# Altium schematic sheet 0227_GPU_ DEBUG.SchDoc
size 848 x 558 mm
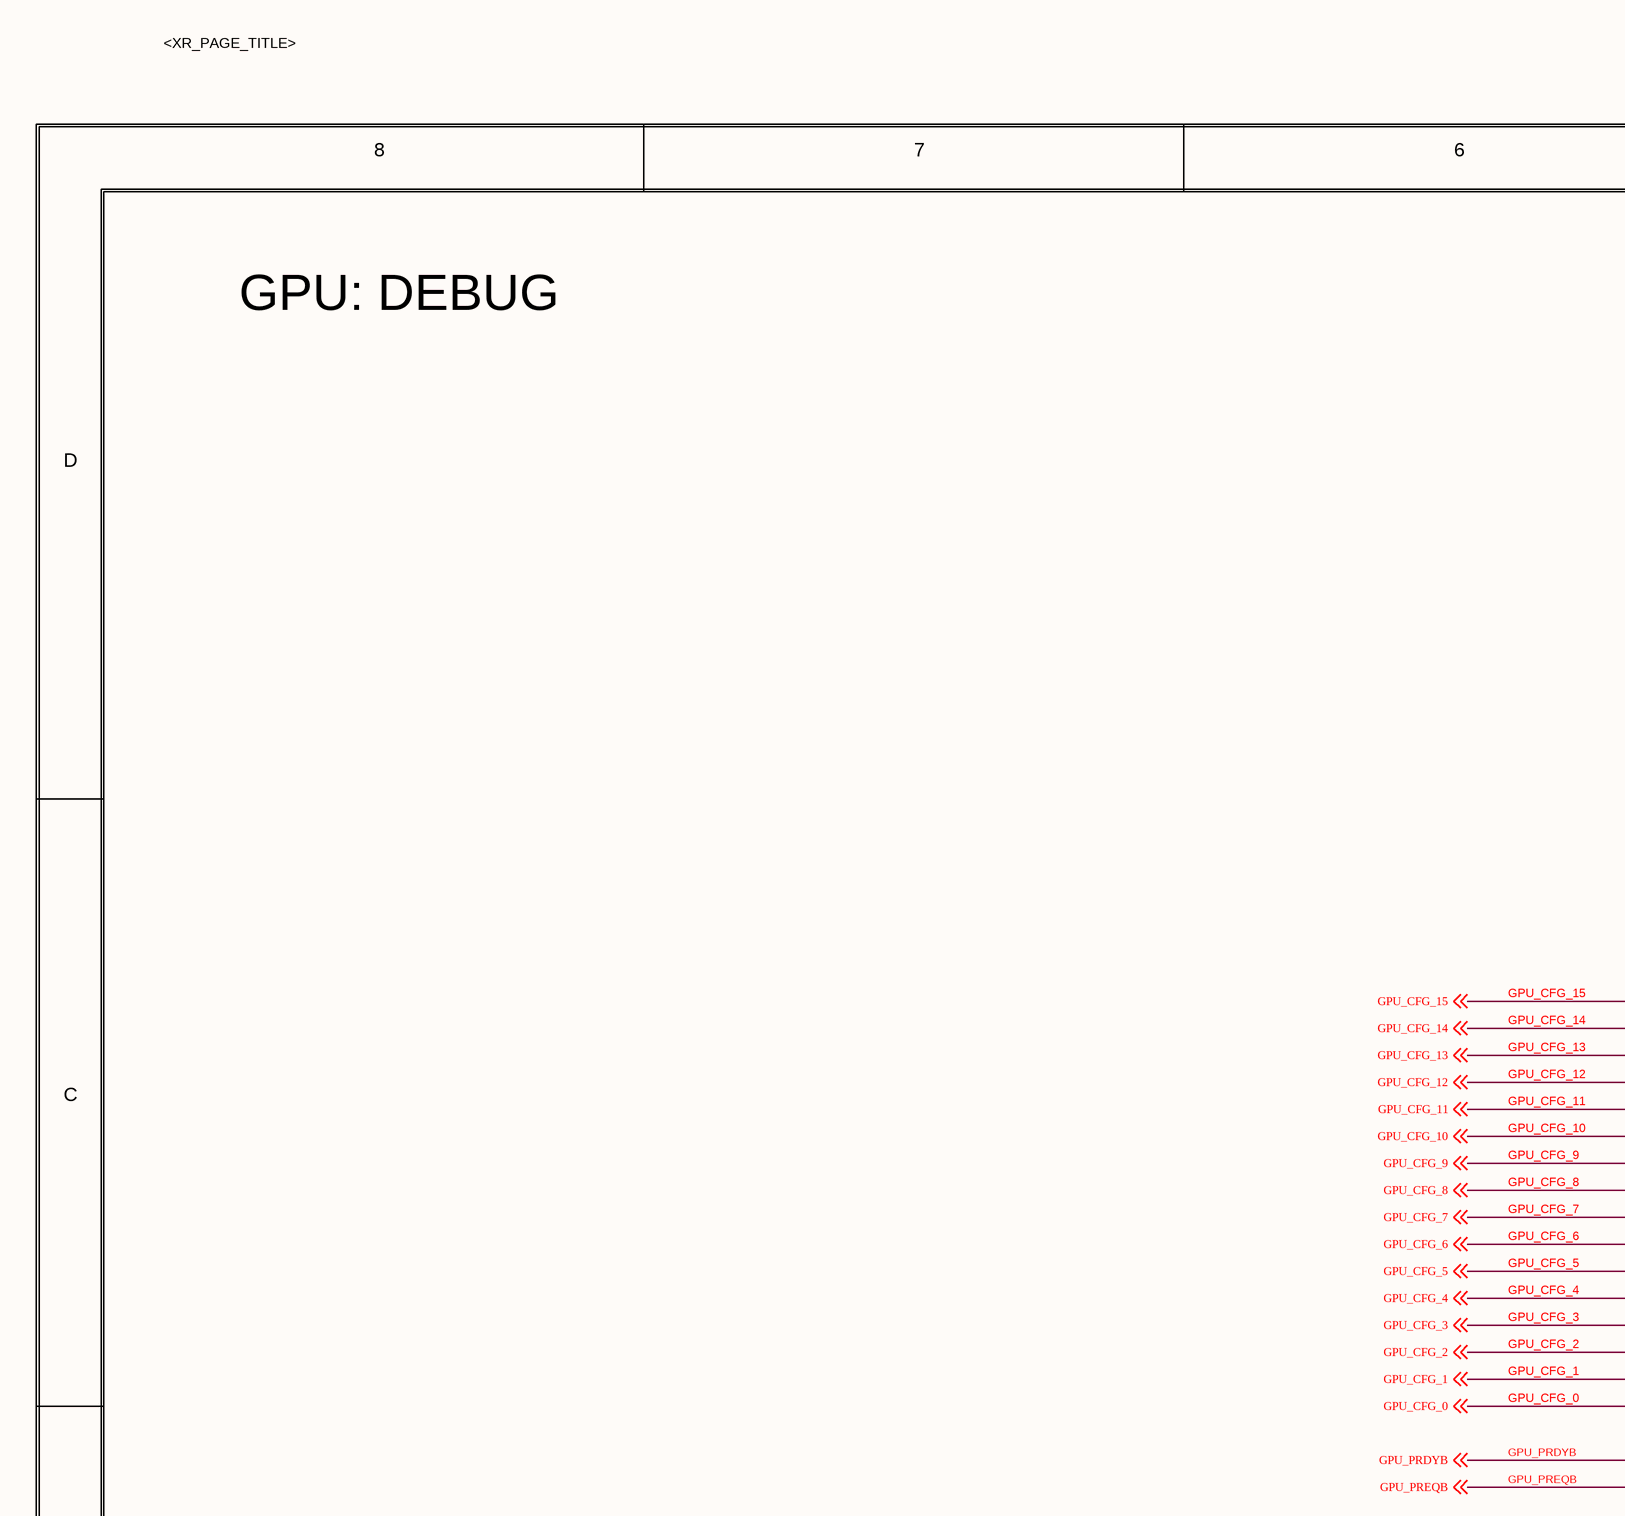
[diagram p0: 0227_GPU_ DEBUG.SchDoc, top left]
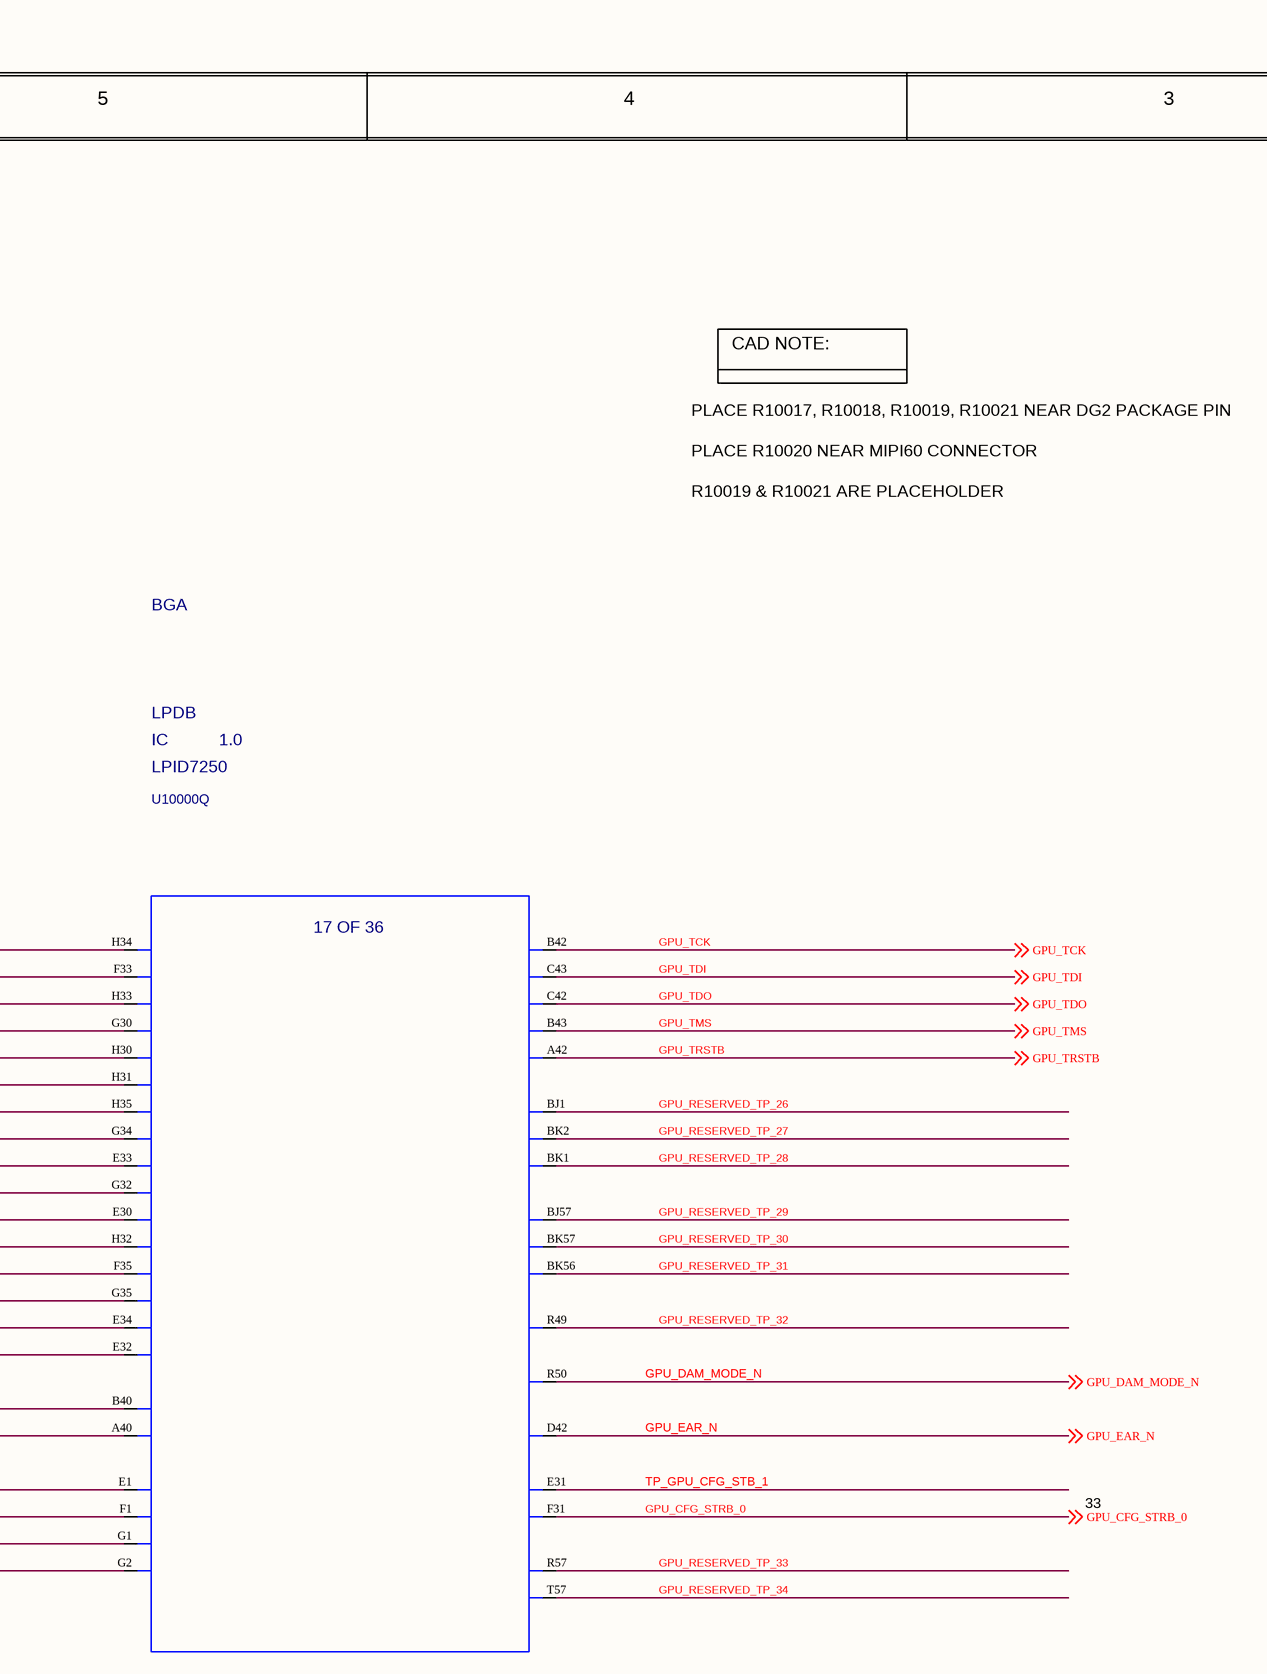
[diagram p1: 0227_GPU_ DEBUG.SchDoc, top middle]
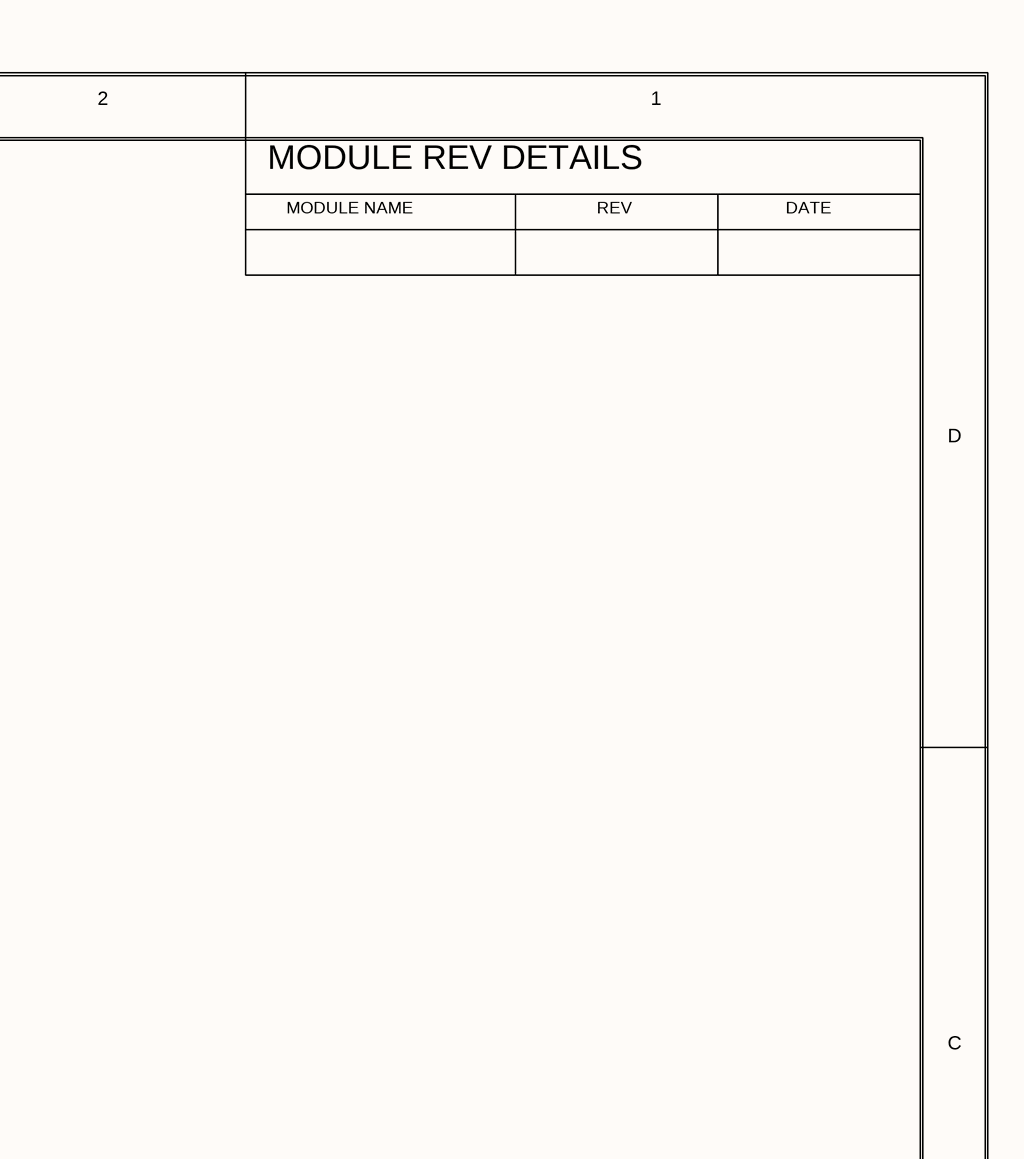
[diagram p2: 0227_GPU_ DEBUG.SchDoc, top right]
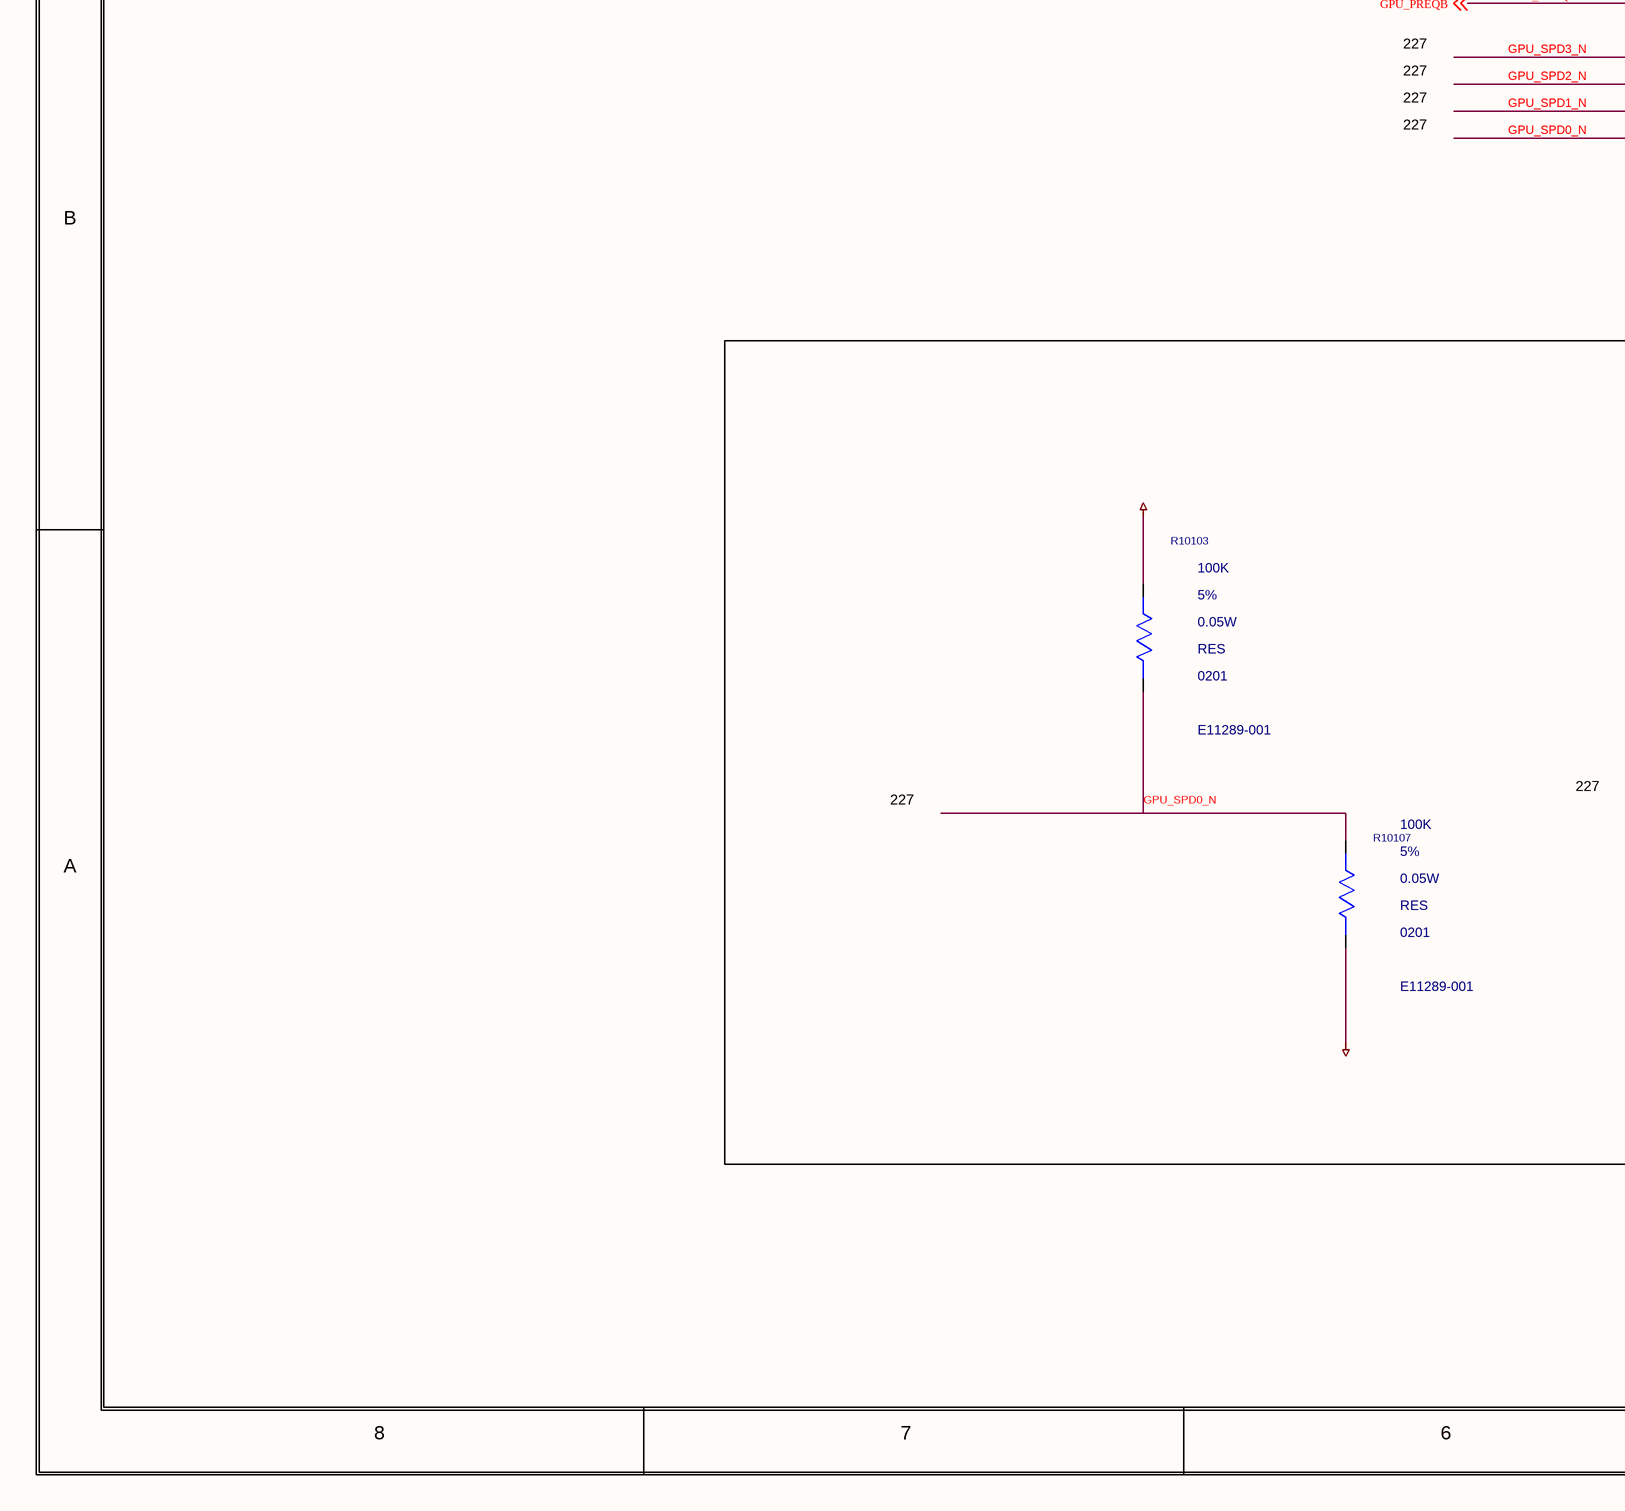
[diagram p3: 0227_GPU_ DEBUG.SchDoc, bottom left]
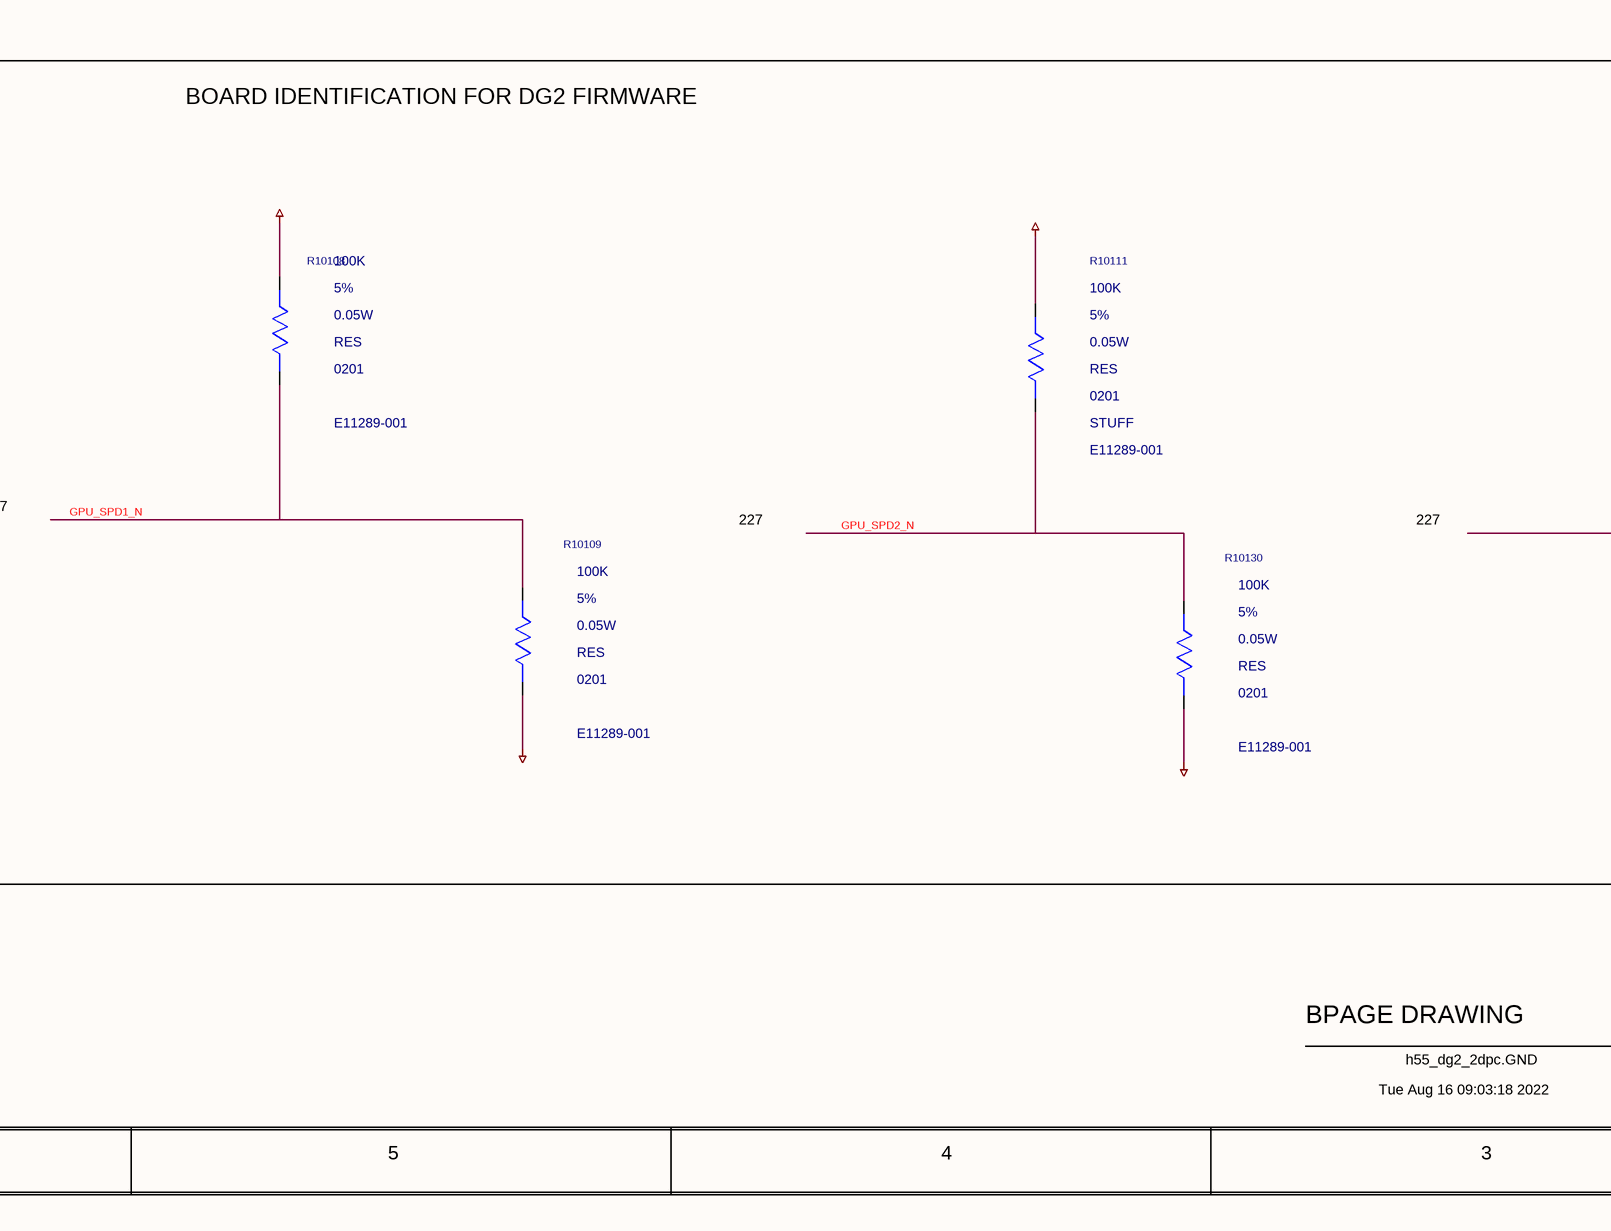
[diagram p4: 0227_GPU_ DEBUG.SchDoc, bottom middle]
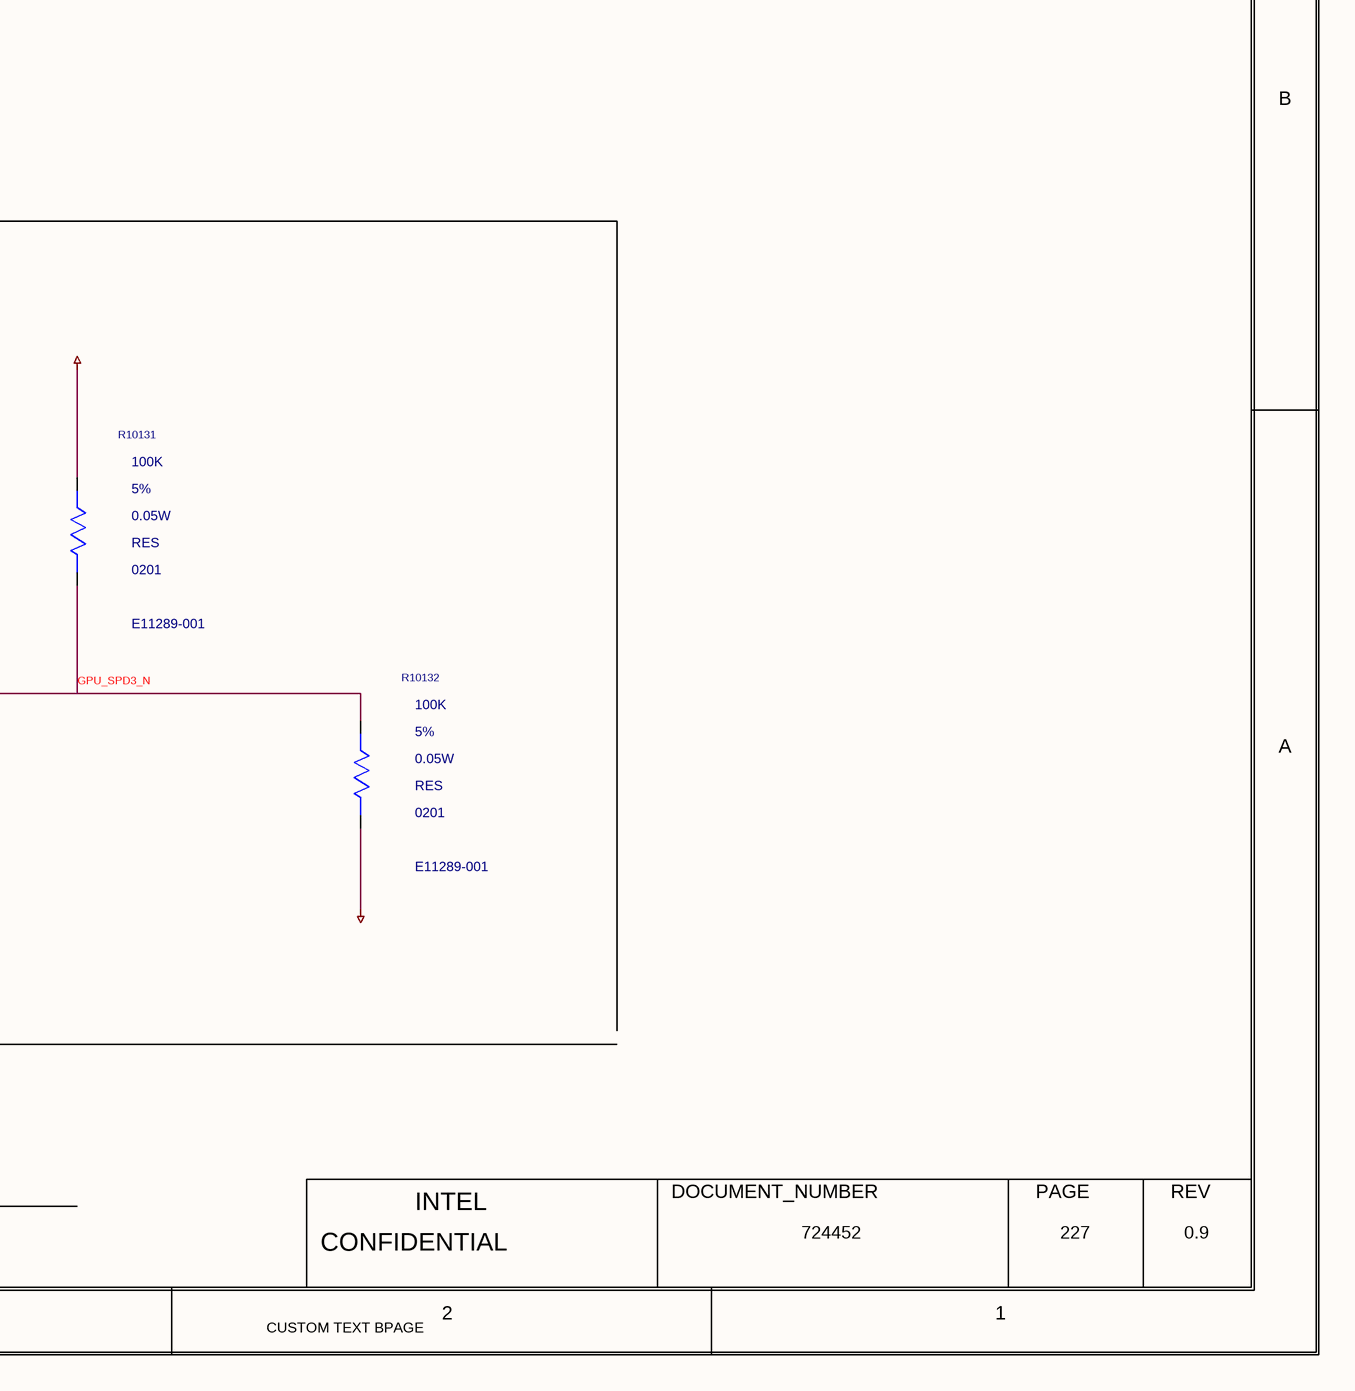
[diagram p5: 0227_GPU_ DEBUG.SchDoc, bottom right]

## Parts
R10103  100K  MATERIAL: RES  PACK_TYPE: 0201  PART_NUMBER: E11289-001  TOLERANCE: 5%  WATTAGE: 0.05W  [TK0_SM0201_650X350_MB]
R10107  100K  MATERIAL: RES  PACK_TYPE: 0201  PART_NUMBER: E11289-001  TOLERANCE: 5%  WATTAGE: 0.05W  [TK0_SM0201_650X350_MB]
R10108  100K  MATERIAL: RES  PACK_TYPE: 0201  PART_NUMBER: E11289-001  TOLERANCE: 5%  WATTAGE: 0.05W  [TK0_SM0201_650X350_MB]
R10109  100K  MATERIAL: RES  PACK_TYPE: 0201  PART_NUMBER: E11289-001  TOLERANCE: 5%  WATTAGE: 0.05W  [TK0_SM0201_650X350_MB]
R10111  100K  BOM_USE: STUFF  MATERIAL: RES  PACK_TYPE: 0201  PART_NUMBER: E11289-001  TOLERANCE: 5%  WATTAGE: 0.05W  [TK0_SM0201_650X350_MB]
R10130  100K  MATERIAL: RES  PACK_TYPE: 0201  PART_NUMBER: E11289-001  TOLERANCE: 5%  WATTAGE: 0.05W  [TK0_SM0201_650X350_MB]
R10131  100K  MATERIAL: RES  PACK_TYPE: 0201  PART_NUMBER: E11289-001  TOLERANCE: 5%  WATTAGE: 0.05W  [TK0_SM0201_650X350_MB]
R10132  100K  MATERIAL: RES  PACK_TYPE: 0201  PART_NUMBER: E11289-001  TOLERANCE: 5%  WATTAGE: 0.05W  [TK0_SM0201_650X350_MB]
U10000  PART_NUMBER: LPID7250  PACK_TYPE: BGA  MATERIAL: IC  FP_TECH: LPDB  BMAP_REV: 1.0  [CLPDB_BGA2660_DG2_SVC_512_LP7250_MA]  (hidden comment: DG2_IP_NB_SKU1_SKU2_SKU3_EXT)  (part Q of 36)

## Nets
+V1P8S_GPU: R10103.1(A) R10108.1(A) R10111.1(A) R10131.1(A)
GND: R10107.2(B) R10109.2(B) R10130.2(B) R10132.2(B)
GPU_CFG_0: U10000.E32(CFG_0) ; off-sheet GPU_CFG_0
GPU_CFG_1: U10000.E34(CFG_1) ; off-sheet GPU_CFG_1
GPU_CFG_2: U10000.G35(CFG_2) ; off-sheet GPU_CFG_2
GPU_CFG_3: U10000.F35(CFG_3) ; off-sheet GPU_CFG_3
GPU_CFG_4: U10000.H32(CFG_4) ; off-sheet GPU_CFG_4
GPU_CFG_5: U10000.E30(CFG_5) ; off-sheet GPU_CFG_5
GPU_CFG_6: U10000.G32(CFG_6) ; off-sheet GPU_CFG_6
GPU_CFG_7: U10000.E33(CFG_7) ; off-sheet GPU_CFG_7
GPU_CFG_8: U10000.G34(CFG_8) ; off-sheet GPU_CFG_8
GPU_CFG_9: U10000.H35(CFG_9) ; off-sheet GPU_CFG_9
GPU_CFG_10: U10000.H31(CFG_10) ; off-sheet GPU_CFG_10
GPU_CFG_11: U10000.H30(CFG_11) ; off-sheet GPU_CFG_11
GPU_CFG_12: U10000.G30(CFG_12) ; off-sheet GPU_CFG_12
GPU_CFG_13: U10000.H33(CFG_13) ; off-sheet GPU_CFG_13
GPU_CFG_14: U10000.F33(CFG_14) ; off-sheet GPU_CFG_14
GPU_CFG_15: U10000.H34(CFG_15) ; off-sheet GPU_CFG_15
GPU_CFG_STRB_0: U10000.F31(CFG_STRB_0) ; off-sheet GPU_CFG_STRB_0
GPU_DAM_MODE_N: U10000.R50(DAM_MODE#) ; off-sheet GPU_DAM_MODE_N
GPU_EAR_N: U10000.D42(EAR#) ; off-sheet GPU_EAR_N
GPU_PRDYB: U10000.B40(PROC_PRDY#) ; off-sheet GPU_PRDYB
GPU_PREQB: U10000.A40(PROC_PREQ#) ; off-sheet GPU_PREQB
GPU_RESERVED_TP_26: U10000.BJ1(RSVD_TP_26)
GPU_RESERVED_TP_27: U10000.BK2(RSVD_TP_27)
GPU_RESERVED_TP_28: U10000.BK1(RSVD_TP_28)
GPU_RESERVED_TP_29: U10000.BJ57(RSVD_TP_29)
GPU_RESERVED_TP_30: U10000.BK57(RSVD_TP_30)
GPU_RESERVED_TP_31: U10000.BK56(RSVD_TP_31)
GPU_RESERVED_TP_32: U10000.R49(RSVD_TP_32)
GPU_RESERVED_TP_33: U10000.R57(RSVD_TP_33)
GPU_RESERVED_TP_34: U10000.T57(RSVD_TP_34)
GPU_SPD0_N: R10103.2(B) R10107.1(A) U10000.G2(STRAP_0)
GPU_SPD1_N: R10108.2(B) R10109.1(A) U10000.G1(STRAP_1)
GPU_SPD2_N: R10111.2(B) R10130.1(A) U10000.F1(STRAP_2)
GPU_SPD3_N: R10131.2(B) R10132.1(A) U10000.E1(STRAP_3)
GPU_TCK: U10000.B42(TCK) ; off-sheet GPU_TCK
GPU_TDI: U10000.C43(TDI) ; off-sheet GPU_TDI
GPU_TDO: U10000.C42(TDO) ; off-sheet GPU_TDO
GPU_TMS: U10000.B43(TMS) ; off-sheet GPU_TMS
GPU_TRSTB: U10000.A42(TRST#) ; off-sheet GPU_TRSTB
TP_GPU_CFG_STB_1: U10000.E31(CFG_STRB_1)

## Notes on the sheet
- <XR_PAGE_TITLE>
- 8
- 7
- 6
- 5
- 4
- 3
- 2
- 1
- MODULE REV DETAILS
- GPU: DEBUG
- MODULE NAME
- REV
- DATE
- CAD NOTE:
- D
- PLACE R10020 NEAR MIPI60 CONNECTOR
- PLACE R10017, R10018, R10019, R10021 NEAR DG2 PACKAGE PIN
- R10019 & R10021 ARE PLACEHOLDER
- C
- 227
- 33
- B
- BOARD IDENTIFICATION FOR DG2 FIRMWARE
- A
- BPAGE DRAWING
- INTEL
- DOCUMENT_NUMBER
- PAGE
- Tue Aug 16 09:03:18 2022
- h55_dg2_2dpc.GND
- CONFIDENTIAL
- 724452
- 0.9
- CUSTOM TEXT BPAGE
- (in symbol DG2_IP_NB_SKU1_SKU2_SKU3_EXT, part Q) 17 OF 36

## Library data of the parts
R10103 = RES_2: CDS_PHYS_PART_NAME: RES_2_0201-E11289-001,RES,100K,5%,0.05W,TK0,GENERIC; BOM_USE: STUFF; CDS_LMAN_SYM_OUTLINE: -50,50,50,-50; FP_TECH: TK0; IP: GENERIC; ROOM: NONE; OriginalSymbolOrigin: (-25,75); XY: (-6225,1075); VER: 2; ROT: 0; PHYS_PAGE: 227; LOCATION: R10103; DRAWING: @RVP1_ADL_SB_ADP_S_DDR5_SODIMM_2DPC_LIB.H55_DG2_2DPC(SCH_1):PAGE398; CDS_LIB: discrete_2; VARIANT: ?; PCB Footprint: TK0_SM0201_650X350_MB; CHIPS_PART_NAME: RES_2; CDS_PART_NAME: RES_2_0201-E11289-001,RES,100K,5%,0.05W,TK0,GENERIC; CDS_LOCATION: R10103
R10107 = RES_2: CDS_PHYS_PART_NAME: RES_2_0201-E11289-001,RES,100K,5%,0.05W,TK0,GENERIC; BOM_USE: STUFF; CDS_LMAN_SYM_OUTLINE: -50,50,50,-50; FP_TECH: TK0; IP: GENERIC; ROOM: NONE; OriginalSymbolOrigin: (-25,75); XY: (-5850,600); VER: 2; ROT: 0; PHYS_PAGE: 227; LOCATION: R10107; DRAWING: @RVP1_ADL_SB_ADP_S_DDR5_SODIMM_2DPC_LIB.H55_DG2_2DPC(SCH_1):PAGE398; CDS_LIB: discrete_2; VARIANT: ?; PCB Footprint: TK0_SM0201_650X350_MB; CHIPS_PART_NAME: RES_2; CDS_PART_NAME: RES_2_0201-E11289-001,RES,100K,5%,0.05W,TK0,GENERIC; CDS_LOCATION: R10107
R10108 = RES_2: CDS_PHYS_PART_NAME: RES_2_0201-E11289-001,RES,100K,5%,0.05W,TK0,GENERIC; BOM_USE: STUFF; CDS_LMAN_SYM_OUTLINE: -50,50,50,-50; FP_TECH: TK0; IP: GENERIC; ROOM: NONE; OriginalSymbolOrigin: (-25,75); XY: (-4875,1125); VER: 2; ROT: 0; PHYS_PAGE: 227; LOCATION: R10108; DRAWING: @RVP1_ADL_SB_ADP_S_DDR5_SODIMM_2DPC_LIB.H55_DG2_2DPC(SCH_1):PAGE398; CDS_LIB: discrete_2; VARIANT: ?; PCB Footprint: TK0_SM0201_650X350_MB; CHIPS_PART_NAME: RES_2; CDS_PART_NAME: RES_2_0201-E11289-001,RES,100K,5%,0.05W,TK0,GENERIC; CDS_LOCATION: R10108
R10109 = RES_2: CDS_PHYS_PART_NAME: RES_2_0201-E11289-001,RES,100K,5%,0.05W,TK0,GENERIC; BOM_USE: STUFF; CDS_LMAN_SYM_OUTLINE: -50,50,50,-50; FP_TECH: TK0; IP: GENERIC; ROOM: NONE; OriginalSymbolOrigin: (-25,75); XY: (-4425,550); VER: 2; ROT: 0; PHYS_PAGE: 227; LOCATION: R10109; DRAWING: @RVP1_ADL_SB_ADP_S_DDR5_SODIMM_2DPC_LIB.H55_DG2_2DPC(SCH_1):PAGE398; CDS_LIB: discrete_2; VARIANT: ?; PCB Footprint: TK0_SM0201_650X350_MB; CHIPS_PART_NAME: RES_2; CDS_PART_NAME: RES_2_0201-E11289-001,RES,100K,5%,0.05W,TK0,GENERIC; CDS_LOCATION: R10109
R10111 = RES_2: CDS_PHYS_PART_NAME: RES_2_0201-E11289-001,RES,100K,5%,0.05W,TK0,GENERIC; CDS_LMAN_SYM_OUTLINE: -50,50,50,-50; FP_TECH: TK0; IP: GENERIC; ROOM: NONE; OriginalSymbolOrigin: (-25,75); XY: (-3475,1075); VER: 2; ROT: 0; PHYS_PAGE: 227; LOCATION: R10111; DRAWING: @RVP1_ADL_SB_ADP_S_DDR5_SODIMM_2DPC_LIB.H55_DG2_2DPC(SCH_1):PAGE398; CDS_LIB: discrete_2; VARIANT: ?; PCB Footprint: TK0_SM0201_650X350_MB; CHIPS_PART_NAME: RES_2; CDS_PART_NAME: RES_2_0201-E11289-001,RES,100K,5%,0.05W,TK0,GENERIC; CDS_LOCATION: R10111
R10130 = RES_2: CDS_PHYS_PART_NAME: RES_2_0201-E11289-001,RES,100K,5%,0.05W,TK0,GENERIC; BOM_USE: STUFF; CDS_LMAN_SYM_OUTLINE: -50,50,50,-50; FP_TECH: TK0; IP: GENERIC; ROOM: NONE; OriginalSymbolOrigin: (-25,75); XY: (-3200,525); VER: 2; ROT: 0; PHYS_PAGE: 227; LOCATION: R10130; DRAWING: @RVP1_ADL_SB_ADP_S_DDR5_SODIMM_2DPC_LIB.H55_DG2_2DPC(SCH_1):PAGE398; CDS_LIB: discrete_2; VARIANT: ?; PCB Footprint: TK0_SM0201_650X350_MB; CHIPS_PART_NAME: RES_2; CDS_PART_NAME: RES_2_0201-E11289-001,RES,100K,5%,0.05W,TK0,GENERIC; CDS_LOCATION: R10130
R10131 = RES_2: CDS_PHYS_PART_NAME: RES_2_0201-E11289-001,RES,100K,5%,0.05W,TK0,GENERIC; BOM_USE: STUFF; CDS_LMAN_SYM_OUTLINE: -50,50,50,-50; FP_TECH: TK0; IP: GENERIC; ROOM: NONE; OriginalSymbolOrigin: (-25,75); XY: (-2325,1050); VER: 2; ROT: 0; PHYS_PAGE: 227; LOCATION: R10131; DRAWING: @RVP1_ADL_SB_ADP_S_DDR5_SODIMM_2DPC_LIB.H55_DG2_2DPC(SCH_1):PAGE398; CDS_LIB: discrete_2; VARIANT: ?; PCB Footprint: TK0_SM0201_650X350_MB; CHIPS_PART_NAME: RES_2; CDS_PART_NAME: RES_2_0201-E11289-001,RES,100K,5%,0.05W,TK0,GENERIC; CDS_LOCATION: R10131
R10132 = RES_2: CDS_PHYS_PART_NAME: RES_2_0201-E11289-001,RES,100K,5%,0.05W,TK0,GENERIC; BOM_USE: STUFF; CDS_LMAN_SYM_OUTLINE: -50,50,50,-50; FP_TECH: TK0; IP: GENERIC; ROOM: NONE; OriginalSymbolOrigin: (-25,75); XY: (-1800,600); VER: 2; ROT: 0; PHYS_PAGE: 227; LOCATION: R10132; DRAWING: @RVP1_ADL_SB_ADP_S_DDR5_SODIMM_2DPC_LIB.H55_DG2_2DPC(SCH_1):PAGE398; CDS_LIB: discrete_2; VARIANT: ?; PCB Footprint: TK0_SM0201_650X350_MB; CHIPS_PART_NAME: RES_2; CDS_PART_NAME: RES_2_0201-E11289-001,RES,100K,5%,0.05W,TK0,GENERIC; CDS_LOCATION: R10132
U10000 = DG2_IP_NB_SKU1_SKU2_SKU3_EXT: MANUF: INTEL CORP; CDS_PHYS_PART_NAME: DG2_IP_NB_SKU1_SKU2_SKU3_EXT_BGA-LPID7250,IC,DG2_IP_NB_SKU1_SKUA; CDS_LMAN_SYM_OUTLINE: -300,850,300,-800; OriginalSymbolOrigin: (-325,850); CaptureCellPackProp: DG2_IP_NB_SKU1_SKU2_SKU3_EXTQ; XY: (-4200,2550); VER: 17; ROT: 0; PHYS_PAGE: 227; MFG_PN: NONE; LOCATION: U10000; DRAWING: @RVP1_ADL_SB_ADP_S_DDR5_SODIMM_2DPC_LIB.H55_DG2_2DPC(SCH_1):PAGE398; CDS_LIB: rvp1_adl_sb_adp_s_ddr5_sodimm_2dpc_lib; PCB Footprint: CLPDB_BGA2660_DG2_SVC_512_LP7250_MA; SEC_TYPE: BGA; CHIPS_PART_NAME: DG2_IP_NB_SKU1_SKU2_SKU3_EXT; CDS_PART_NAME: DG2_IP_NB_SKU1_SKU2_SKU3_EXT_BGA-LPID7250,IC,DG2_IP_NB_SKU1_SKUA; CDS_LOCATION: U10000